# Altium schematic sheet USB DV Stick 1V1_Sheet3.SchDoc: USB DV stick
size B; CompanyName: LoneStar; Organization: LoneStar; Address1: 1005 Lela; Address2: McKinney, Texas 75069; DocumentNumber: 190724-1; Revision: 1V1; SheetNumber: 3; SheetTotal: 3
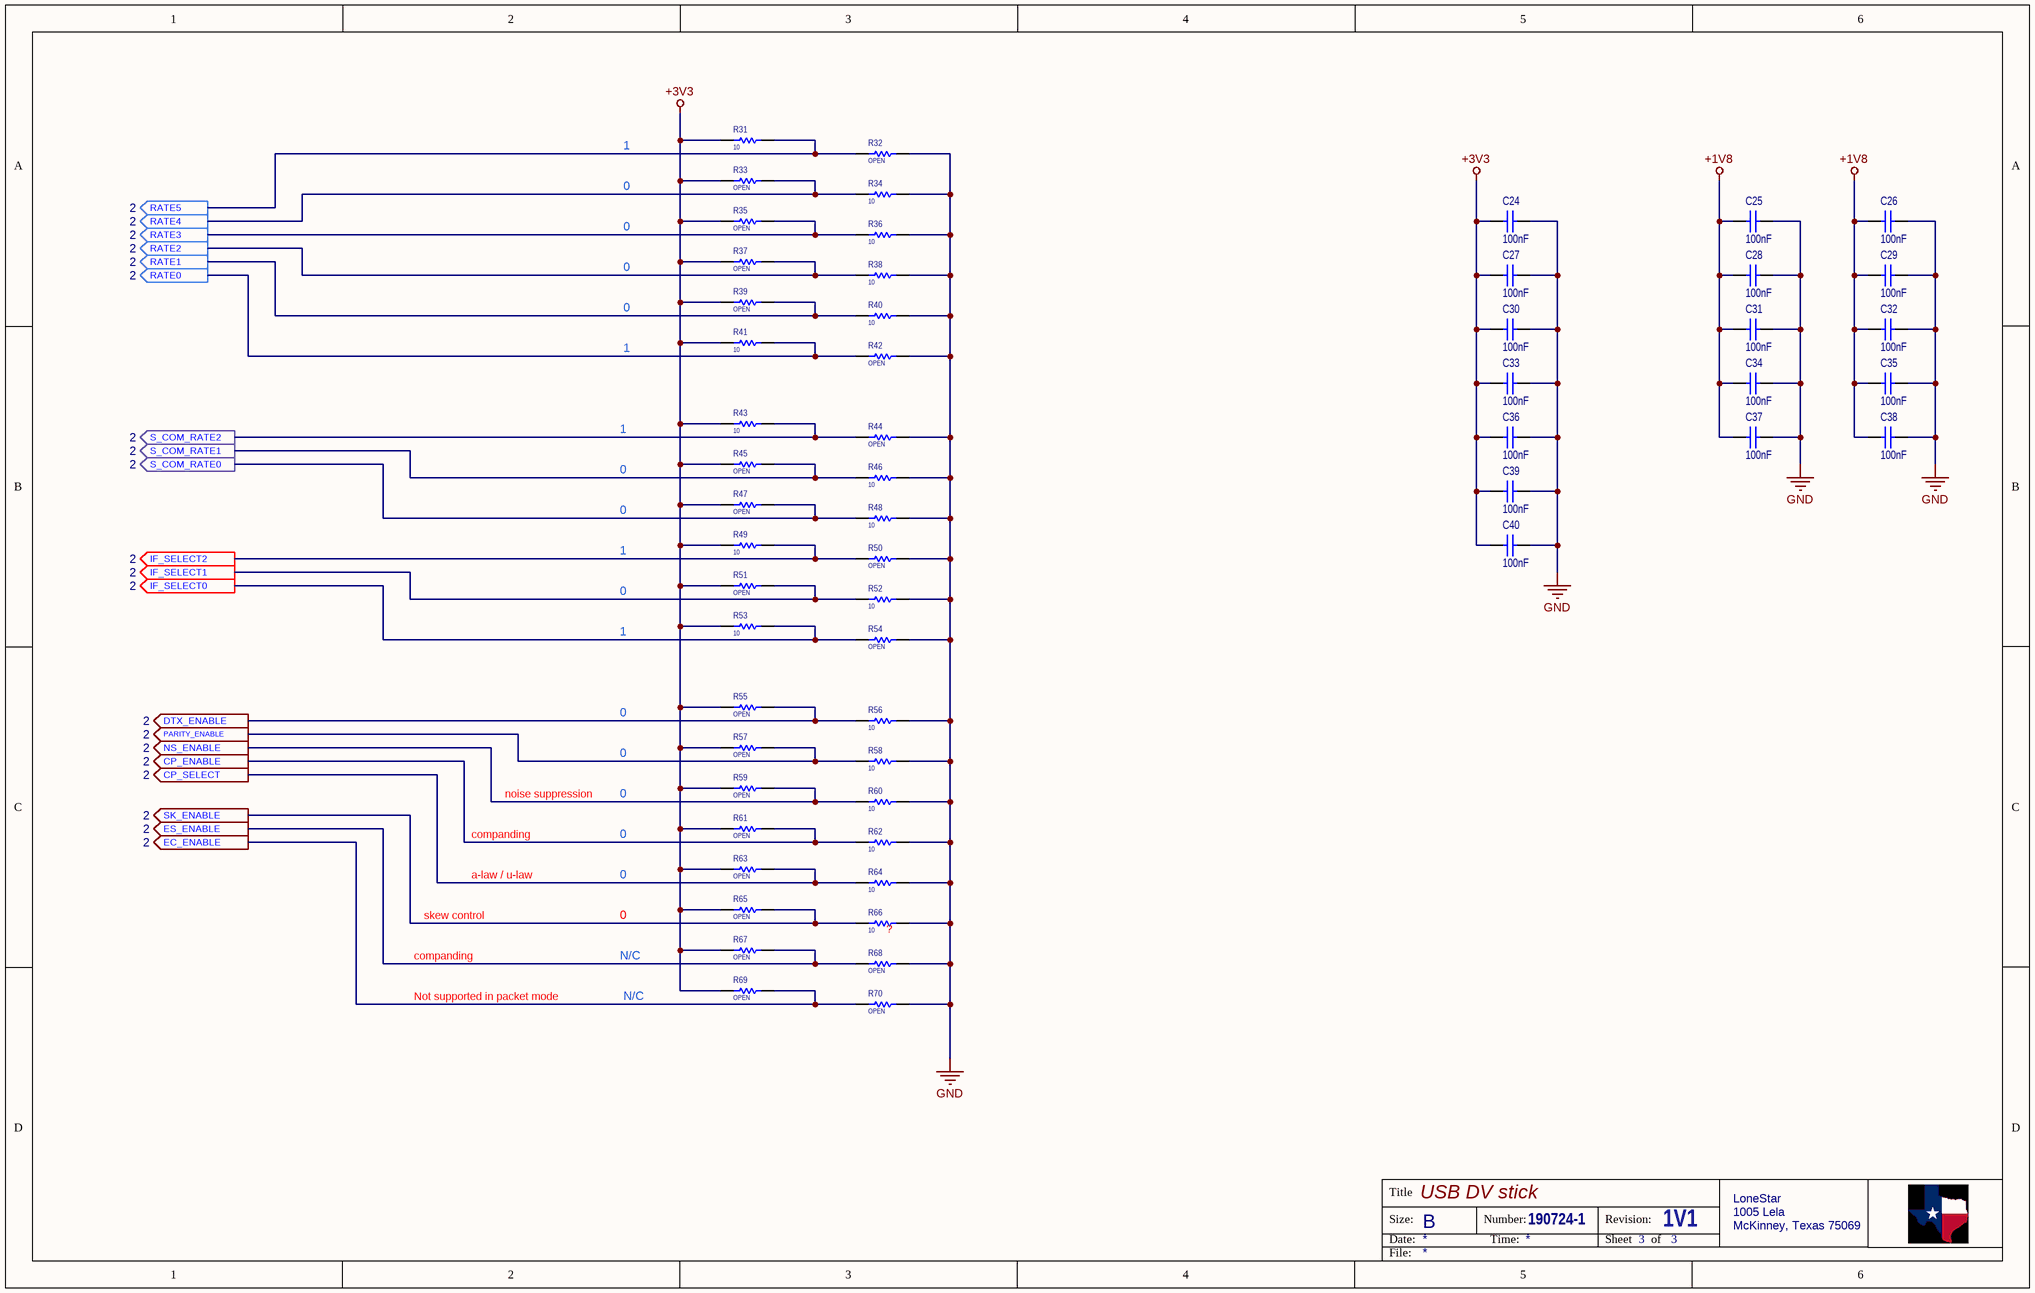
[diagram p0: USB DV Stick 1V1_Sheet3.SchDoc]

## Parts
C24  100nF  [C0402]
C25  100nF  [C0402]
C26  100nF  [C0402]
C27  100nF  [C0402]
C28  100nF  [C0402]
C29  100nF  [C0402]
C30  100nF  [C0402]
C31  100nF  [C0402]
C32  100nF  [C0402]
C33  100nF  [C0402]
C34  100nF  [C0402]
C35  100nF  [C0402]
C36  100nF  [C0402]
C37  100nF  [C0402]
C38  100nF  [C0402]
C39  100nF  [C0402]
C40  100nF  [C0402]
R31  10  [R0603]
R32  OPEN  [R0603]
R33  OPEN  [R0603]
R34  10  [R0603]
R35  OPEN  [R0603]
R36  10  [R0603]
R37  OPEN  [R0603]
R38  10  [R0603]
R39  OPEN  [R0603]
R40  10  [R0603]
R41  10  [R0603]
R42  OPEN  [R0603]
R43  10  [R0603]
R44  OPEN  [R0603]
R45  OPEN  [R0603]
R46  10  [R0603]
R47  OPEN  [R0603]
R48  10  [R0603]
R49  10  [R0603]
R50  OPEN  [R0603]
R51  OPEN  [R0603]
R52  10  [R0603]
R53  10  [R0603]
R54  OPEN  [R0603]
R55  OPEN  [R0603]
R56  10  [R0603]
R57  OPEN  [R0603]
R58  10  [R0603]
R59  OPEN  [R0603]
R60  10  [R0603]
R61  OPEN  [R0603]
R62  10  [R0603]
R63  OPEN  [R0603]
R64  10  [R0603]
R65  OPEN  [R0603]
R66  10  [R0603]
R67  OPEN  [R0603]
R68  OPEN  [R0603]
R69  OPEN  [R0603]
R70  OPEN  [R0603]

## Ports
CP_ENABLE (out, see 2), CP_SELECT (out, see 2), DTX_ENABLE (out, see 2), EC_ENABLE (out, see 2), ES_ENABLE (out, see 2), IF_SELECT0 (out, see 2), IF_SELECT1 (out, see 2), IF_SELECT2 (out, see 2), NS_ENABLE (out, see 2), PARITY_ENABLE (out, see 2), RATE0 (out, see 2), RATE1 (out, see 2), RATE2 (out, see 2), RATE3 (out, see 2), RATE4 (out, see 2), RATE5 (out, see 2), S_COM_RATE0 (out, see 2), S_COM_RATE1 (out, see 2), S_COM_RATE2 (out, see 2), SK_ENABLE (out, see 2)

## Nets
+1V8: C25.1 C26.1 C28.1 C29.1 C31.1 C32.1 C34.1 C35.1 C37.1 C38.1
+3V3: C24.1 C27.1 C30.1 C33.1 C36.1 C39.1 C40.1 R31.1 R33.1 R35.1 R37.1 R39.1 R41.1 R43.1 R45.1 R47.1 R49.1 R51.1 R53.1 R55.1 R57.1 R59.1 R61.1 R63.1 R65.1 R67.1 R69.1
GND: C24.2 C25.2 C26.2 C27.2 C28.2 C29.2 C30.2 C31.2 C32.2 C33.2 C34.2 C35.2 C36.2 C37.2 C38.2 C39.2 C40.2 R32.2 R34.2 R36.2 R38.2 R40.2 R42.2 R44.2 R46.2 R48.2 R50.2 R52.2 R54.2 R56.2 R58.2 R60.2 R62.2 R64.2 R66.2 R68.2 R70.2
CP_ENABLE: R61.2 R62.1 ; port CP_ENABLE
CP_SELECT: R63.2 R64.1 ; port CP_SELECT
DTX_ENABLE: R55.2 R56.1 ; port DTX_ENABLE
EC_ENABLE: R69.2 R70.1 ; port EC_ENABLE
ES_ENABLE: R67.2 R68.1 ; port ES_ENABLE
IF_SELECT0: R53.2 R54.1 ; port IF_SELECT0
IF_SELECT1: R51.2 R52.1 ; port IF_SELECT1
IF_SELECT2: R49.2 R50.1 ; port IF_SELECT2
NS_ENABLE: R59.2 R60.1 ; port NS_ENABLE
PARITY_ENABLE: R57.2 R58.1 ; port PARITY_ENABLE
RATE0: R41.2 R42.1 ; port RATE0
RATE1: R39.2 R40.1 ; port RATE1
RATE2: R37.2 R38.1 ; port RATE2
RATE3: R35.2 R36.1 ; port RATE3
RATE4: R33.2 R34.1 ; port RATE4
RATE5: R31.2 R32.1 ; port RATE5
S_COM_RATE0: R47.2 R48.1 ; port S_COM_RATE0
S_COM_RATE1: R45.2 R46.1 ; port S_COM_RATE1
S_COM_RATE2: R43.2 R44.1 ; port S_COM_RATE2
SK_ENABLE: R65.2 R66.1 ; port SK_ENABLE

## Notes on the sheet
- 1
- 0
- companding
- noise suppression
- a-law / u-law
- skew control
- N/C
- (near R66) ?
- Not supported in packet mode
- Title
- Size:
- Date:
- B
- Number:
- Time:
- Revision:
- Sheet
- of
- File:

## Library data of the parts
C24-C40 = Cap SM: Capacitor Surface Mount; Manufacturer: Murata Electronics; Manufacturer Part Number: GRM155R61H104KE19D; PackageReference: C0603; PackageDescription: Chip Capacitor; Value: 100nF; Supplier 1: Mouser; Supplier Part Number 1: 81-GRM155R61H104KE9D
R31 R34 R36 R38 R40 R41 R43 R46 R48 R49 R52 R53 R56 R58 R60 R62 R64 R66 = RES SM: Resistor Surface Mount; Manufacturer: Vishay / Dale; Manufacturer Part Number: CRCW060310R0FKEAC; PackageReference: R0603; PackageDescription: Surface Mount; Value: 10; Supplier 1: Mouser; Supplier Part Number 1: 71-CRCW060310R0FKEAC
R32 R33 R35 R37 R39 R42 R44 R45 R47 R50 R51 R54 R55 R57 R59 R61 R63 R65 R67-R70 = RES SM: Resistor Surface Mount; PackageReference: R0603; PackageDescription: Surface Mount; Value: OPEN; Supplier 1: N/A; Manufacturer: N/A; Supplier Part Number 1: N/A; Manufacturer Part Number: N/A